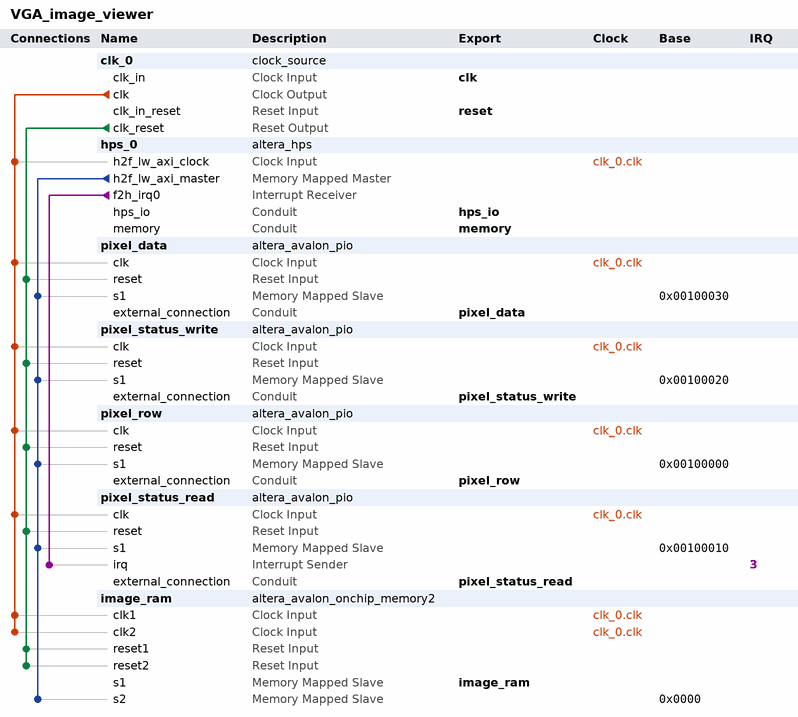
[diagram p0: system contents]
# Platform Designer (Qsys) system VGA_image_viewer, Cyclone V 5CSEMA5F31C6
# Parameters at their usual value, and those the tool derives, are not listed.
package require -exact qsys 18.1
create_system VGA_image_viewer
set_project_property DEVICE_FAMILY {Cyclone V}
set_project_property DEVICE 5CSEMA5F31C6

add_instance clk_0 clock_source 18.1
set_instance_parameter_value clk_0 clockFrequency 50000000

add_instance hps_0 altera_hps 18.1
set_instance_parameter_value hps_0 EMAC1_Mode RGMII
set_instance_parameter_value hps_0 EMAC1_PinMuxing {HPS I/O Set 0}
set_instance_parameter_value hps_0 F2SCLK_COLDRST_Enable false
set_instance_parameter_value hps_0 F2SCLK_DBGRST_Enable false
set_instance_parameter_value hps_0 F2SCLK_WARMRST_Enable false
set_instance_parameter_value hps_0 F2SINTERRUPT_Enable true
set_instance_parameter_value hps_0 F2S_Width 0
set_instance_parameter_value hps_0 FPGA_PERIPHERAL_OUTPUT_CLOCK_FREQ_EMAC0_GTX_CLK 100
set_instance_parameter_value hps_0 FPGA_PERIPHERAL_OUTPUT_CLOCK_FREQ_EMAC0_MD_CLK 100.0
set_instance_parameter_value hps_0 FPGA_PERIPHERAL_OUTPUT_CLOCK_FREQ_EMAC1_GTX_CLK 100
set_instance_parameter_value hps_0 FPGA_PERIPHERAL_OUTPUT_CLOCK_FREQ_EMAC1_MD_CLK 100.0
set_instance_parameter_value hps_0 HPS_PROTOCOL DDR3
set_instance_parameter_value hps_0 I2C0_Mode I2C
set_instance_parameter_value hps_0 I2C0_PinMuxing {HPS I/O Set 0}
set_instance_parameter_value hps_0 I2C1_Mode I2C
set_instance_parameter_value hps_0 I2C1_PinMuxing {HPS I/O Set 0}
set_instance_parameter_value hps_0 LWH2F_Enable true
set_instance_parameter_value hps_0 MEM_BANKADDR_WIDTH 3
set_instance_parameter_value hps_0 MEM_CLK_FREQ 400.0
set_instance_parameter_value hps_0 MEM_COL_ADDR_WIDTH 10
set_instance_parameter_value hps_0 MEM_DQ_WIDTH 32
set_instance_parameter_value hps_0 MEM_DRV_STR RZQ/7
set_instance_parameter_value hps_0 MEM_ROW_ADDR_WIDTH 15
set_instance_parameter_value hps_0 MEM_RTT_NOM RZQ/4
set_instance_parameter_value hps_0 MEM_RTT_WR RZQ/4
set_instance_parameter_value hps_0 MEM_TCL 11
set_instance_parameter_value hps_0 MEM_TFAW_NS 30.0
set_instance_parameter_value hps_0 MEM_TRAS_NS 35.0
set_instance_parameter_value hps_0 MEM_TRCD_NS 13.75
set_instance_parameter_value hps_0 MEM_TRFC_NS 260.0
set_instance_parameter_value hps_0 MEM_TRP_NS 13.75
set_instance_parameter_value hps_0 MEM_VENDOR JEDEC
set_instance_parameter_value hps_0 MEM_WTCL 8
set_instance_parameter_value hps_0 QSPI_Mode {1 SS}
set_instance_parameter_value hps_0 QSPI_PinMuxing {HPS I/O Set 0}
set_instance_parameter_value hps_0 REF_CLK_FREQ 25.0
set_instance_parameter_value hps_0 S2FCLK_USER2CLK 5
set_instance_parameter_value hps_0 S2F_Width 0
set_instance_parameter_value hps_0 SDIO_Mode {4-bit Data}
set_instance_parameter_value hps_0 SDIO_PinMuxing {HPS I/O Set 0}
set_instance_parameter_value hps_0 SPIM1_Mode {Single Slave Select}
set_instance_parameter_value hps_0 SPIM1_PinMuxing {HPS I/O Set 0}
set_instance_parameter_value hps_0 STM_Enable false
set_instance_parameter_value hps_0 TIMING_BOARD_AC_SKEW 0.03
set_instance_parameter_value hps_0 TIMING_BOARD_AC_TO_CK_SKEW 0.0
set_instance_parameter_value hps_0 TIMING_BOARD_DQ_TO_DQS_SKEW 0.0
set_instance_parameter_value hps_0 TIMING_BOARD_MAX_CK_DELAY 0.03
set_instance_parameter_value hps_0 TIMING_BOARD_MAX_DQS_DELAY 0.02
set_instance_parameter_value hps_0 TIMING_BOARD_SKEW_BETWEEN_DQS 0.08
set_instance_parameter_value hps_0 TIMING_BOARD_SKEW_CKDQS_DIMM_MAX 0.16
set_instance_parameter_value hps_0 TIMING_BOARD_SKEW_CKDQS_DIMM_MIN 0.09
set_instance_parameter_value hps_0 TIMING_BOARD_SKEW_WITHIN_DQS 0.01
set_instance_parameter_value hps_0 TIMING_TDH 65
set_instance_parameter_value hps_0 TIMING_TDQSCK 255
set_instance_parameter_value hps_0 TIMING_TDQSQ 125
set_instance_parameter_value hps_0 TIMING_TDS 30
set_instance_parameter_value hps_0 TIMING_TIH 140
set_instance_parameter_value hps_0 TIMING_TIS 180
set_instance_parameter_value hps_0 TIMING_TQSH 0.4
set_instance_parameter_value hps_0 UART0_Mode {No Flow Control}
set_instance_parameter_value hps_0 UART0_PinMuxing {HPS I/O Set 0}
set_instance_parameter_value hps_0 USB1_Mode SDR
set_instance_parameter_value hps_0 USB1_PinMuxing {HPS I/O Set 0}
set_instance_parameter_value hps_0 desired_cfg_clk_mhz 100.0
set_instance_parameter_value hps_0 desired_qspi_clk_mhz 400.0

add_instance pixel_data altera_avalon_pio 18.1
set_instance_parameter_value pixel_data direction Output
set_instance_parameter_value pixel_data width 24

add_instance pixel_status_write altera_avalon_pio 18.1
set_instance_parameter_value pixel_status_write bitClearingEdgeCapReg true
set_instance_parameter_value pixel_status_write captureEdge true
set_instance_parameter_value pixel_status_write direction Output
set_instance_parameter_value pixel_status_write generateIRQ true
set_instance_parameter_value pixel_status_write irqType EDGE
set_instance_parameter_value pixel_status_write width 4

add_instance pixel_row altera_avalon_pio 18.1
set_instance_parameter_value pixel_row direction Input
set_instance_parameter_value pixel_row width 16

add_instance pixel_status_read altera_avalon_pio 18.1
set_instance_parameter_value pixel_status_read captureEdge true
set_instance_parameter_value pixel_status_read direction Input
set_instance_parameter_value pixel_status_read generateIRQ true
set_instance_parameter_value pixel_status_read width 4

add_instance image_ram altera_avalon_onchip_memory2 18.1
set_instance_parameter_value image_ram blockType M10K
set_instance_parameter_value image_ram dataWidth 32
set_instance_parameter_value image_ram dualPort true
set_instance_parameter_value image_ram initMemContent true
set_instance_parameter_value image_ram initializationFileName onchip_mem.hex
set_instance_parameter_value image_ram memorySize 125000

# connections
add_connection clk_0.clk hps_0.h2f_lw_axi_clock clock
add_connection clk_0.clk image_ram.clk1 clock
add_connection clk_0.clk image_ram.clk2 clock
add_connection clk_0.clk pixel_data.clk clock
add_connection clk_0.clk pixel_row.clk clock
add_connection clk_0.clk pixel_status_read.clk clock
add_connection clk_0.clk pixel_status_write.clk clock
add_connection clk_0.clk_reset image_ram.reset1 reset
add_connection clk_0.clk_reset image_ram.reset2 reset
add_connection clk_0.clk_reset pixel_data.reset reset
add_connection clk_0.clk_reset pixel_row.reset reset
add_connection clk_0.clk_reset pixel_status_read.reset reset
add_connection clk_0.clk_reset pixel_status_write.reset reset
add_connection hps_0.h2f_lw_axi_master image_ram.s2 avalon
set_connection_parameter_value hps_0.h2f_lw_axi_master/image_ram.s2 baseAddress 0x0000
add_connection hps_0.h2f_lw_axi_master pixel_data.s1 avalon
set_connection_parameter_value hps_0.h2f_lw_axi_master/pixel_data.s1 baseAddress 0x00100030
add_connection hps_0.h2f_lw_axi_master pixel_row.s1 avalon
set_connection_parameter_value hps_0.h2f_lw_axi_master/pixel_row.s1 baseAddress 0x00100000
add_connection hps_0.h2f_lw_axi_master pixel_status_read.s1 avalon
set_connection_parameter_value hps_0.h2f_lw_axi_master/pixel_status_read.s1 baseAddress 0x00100010
add_connection hps_0.h2f_lw_axi_master pixel_status_write.s1 avalon
set_connection_parameter_value hps_0.h2f_lw_axi_master/pixel_status_write.s1 baseAddress 0x00100020
add_connection hps_0.f2h_irq0 pixel_status_read.irq interrupt
set_connection_parameter_value hps_0.f2h_irq0/pixel_status_read.irq irqNumber 3

# exported interfaces
add_interface clk clock sink
set_interface_property clk EXPORT_OF clk_0.clk_in
add_interface hps_io conduit end
set_interface_property hps_io EXPORT_OF hps_0.hps_io
add_interface image_ram avalon slave
set_interface_property image_ram EXPORT_OF image_ram.s1
add_interface memory conduit end
set_interface_property memory EXPORT_OF hps_0.memory
add_interface pixel_data conduit end
set_interface_property pixel_data EXPORT_OF pixel_data.external_connection
add_interface pixel_row conduit end
set_interface_property pixel_row EXPORT_OF pixel_row.external_connection
add_interface pixel_status_read conduit end
set_interface_property pixel_status_read EXPORT_OF pixel_status_read.external_connection
add_interface pixel_status_write conduit end
set_interface_property pixel_status_write EXPORT_OF pixel_status_write.external_connection
add_interface reset reset sink
set_interface_property reset EXPORT_OF clk_0.clk_in_reset

set_interconnect_requirement {$system} qsys_mm.clockCrossingAdapter HANDSHAKE
set_interconnect_requirement {$system} qsys_mm.enableEccProtection FALSE
set_interconnect_requirement {$system} qsys_mm.insertDefaultSlave FALSE
set_interconnect_requirement {$system} qsys_mm.maxAdditionalLatency 1

save_system VGA_image_viewer.qsys
